# Altium schematic sheet M9-PowerMeas.SchDoc
size A4; ApprovedBy: -; CheckedBy: h.t.t.monfared; Author: h.t.t.monfared; Engineer: h.t.t.monfared; Revision: 1.0; SheetNumber: 9; SheetTotal: 10; Project Code:: UFM Sensor Controller; Document Title:: Power Measurement Sheet
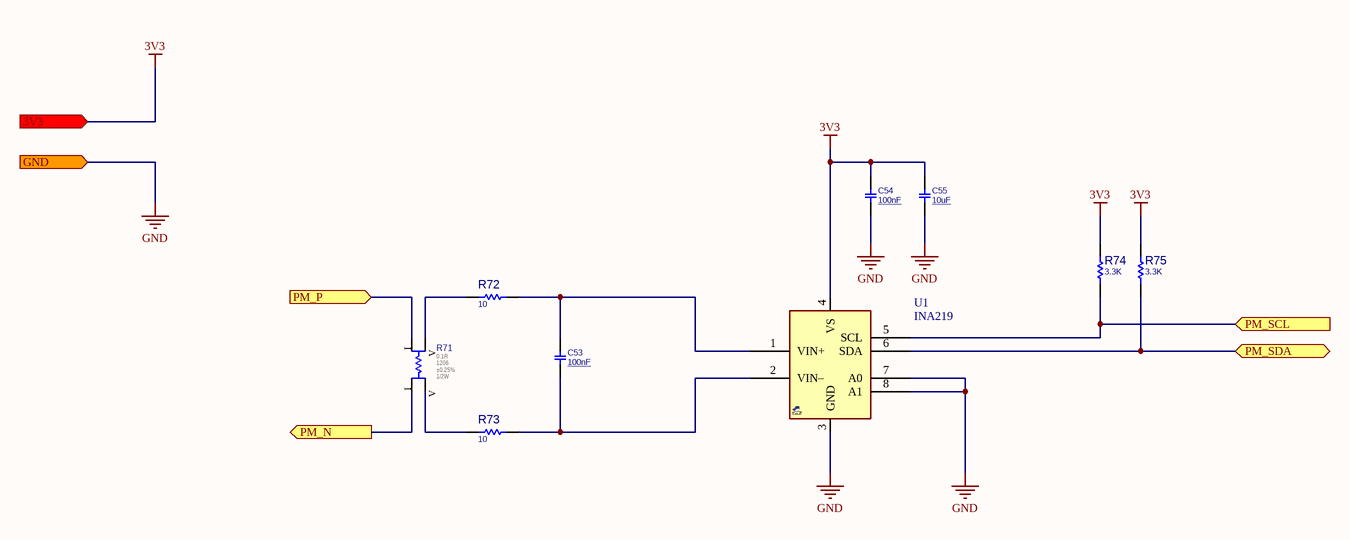
[diagram p0: M9-PowerMeas.SchDoc]

## Parts
C53  100nF  [C1206]
C54  100nF  [C1206]
C55  10uF  [C1206]
R71  0.1R  Package/Case: 1206  Tolerance: ±0.25%  Power: 1/2W  [R-1206_LVK]
R72  10  [R1206]
R73  10  [R1206]
R74  3.3K  [R1206]
R75  3.3K  [R1206]
U1  INA219  [SOT23_8]

## Ports
3V3 (in), GND (in), PM_N (out), PM_P (in), PM_SCL (in), PM_SDA (bidir)

## Nets
3V3: C54.2 C55.2 R74.2 R75.2 U1.4(VS) ; port 3V3
GND: C54.1 C55.1 U1.3(GND) U1.7(A0) U1.8(A1) ; port GND
PM_N: R71.2(I) ; port PM_N
PM_P: R71.4(I) ; port PM_P
PM_SCL: R74.1 U1.5(SCL) ; port PM_SCL
PM_SDA: R75.1 U1.6(SDA) ; port PM_SDA
NetC53_1: C53.1 R73.1 U1.2(VIN–)
NetC53_2: C53.2 R72.1 U1.1(VIN+)
NetR71_1: R71.1(V) R73.2
NetR71_3: R71.3(V) R72.2

## Notes on the sheet
- Project Subject:
- Confidential
- Release by:
- Document Title:
- Create by:
- PCB Code:
- Approve by:
- SVN Rev.:
- Create Date:
- Release Date:
- Approve Date:
- Electronic R&I
- Version:
- Page:
- of
- Template: R01.00, A4

## Library data of the parts
C53-C55 = CAP_SMD_MLCC: CAP, MLCC, 1nF, 50V, C0G, 10%, 0402; MANF_P#: MANF_PART#; MANF: Murata; PARAM: C0G, 10%; PRICE: 100= 1$; DESC: CAP, MLCC, 1nF, 50V, C0G, 10%, 0402; PARAM2: 50V; ASSEMBLY: ASSEMBLY
  C53 C54: VALUE: 100nF
  C55: VALUE: 10uF
R71 = ME05186701: Resistor,S,TF,0.1R,1/2W,0.25%,1206; Manufacturer Code1: 0000103772; Manufacturer Name1: Ohmite Co.; Manufacturer PN1: LVK12R100CER; Unit Price (USD): Coming Soon; Alternative: Please Add; Description Farsi: S,TF,0.1R,1/2W,0.25%,1206,مقاومت; Temperature-Max Operation (TJ): 125℃; Automotive Qualified: Non-Automotive; Packing: TAPE AND REEL; Temperature-Min Operation (TJ): -40℃; Torque-Nominal: Not Applicable; Number of Unit: 1; Designator: R; Voltage-Max Overload: 1.41V; TCR1: ±50; Current-Rated: 20A; Voltage-Max RCWV: 0.224V; Material: ME05186701; Function in Circuit: Please Add; Material Class: Resistor; Type: Chip; Lead Free: YES; ComponentLink1URL: \\192.168.5.63\eRI_ComponentDatabase\Datasheets\SAP\DSH_2024957_00_1.PDF; ComponentLink3URL: \\192.168.5.63\eRI_ComponentDatabase\Datasheets\SAP\DSH_2084726_00_1.PDF; ComponentLink2Description: DSH2027350RE: Application Note-Vishay; Halogen Free: NO; ComponentLink3Description: DSH2084726RE: DSH-PKG-PDT_Ohmite; Termination Style (SMD/THT): SMD; Value: 0.1R; ComponentLink2URL: \\192.168.5.63\eRI_ComponentDatabase\Datasheets\SAP\DSH_2027350_00_1.PDF; ComponentLink1Description: DSH2024957RE: Application Note-Vishay; RoHS: YES; ComponentLink9Description: How to Select
R72-R75 = RES_SMD: RESISTOR, SMD; PARAM: -W; DESC: DESCRIPTION; DIST#: MOUSER; PARAM2: 1%; MANF_P#: -; MANF: -; ASSEMBLY: ASSEMBLY; PRICE: 100= 0.5$
  R72 R73: VALUE: 10
  R74 R75: VALUE: 3.3K
U1 = INA219_SOT23: Current/Power Monitor, Zerø-Drift, Bidirectional, I2C; MANF: TEXAS INSTRUMENTS; MANF_P#: INA219AIDCN, INA219BIDCN; PARAM2: 3~5.5VCC; PARAM: 0~26V, 0.5%, -40~125°C; VALUE: INA219